# Altium schematic sheet LoRaWAN_CC1310_V1.1.SchDoc
size A3
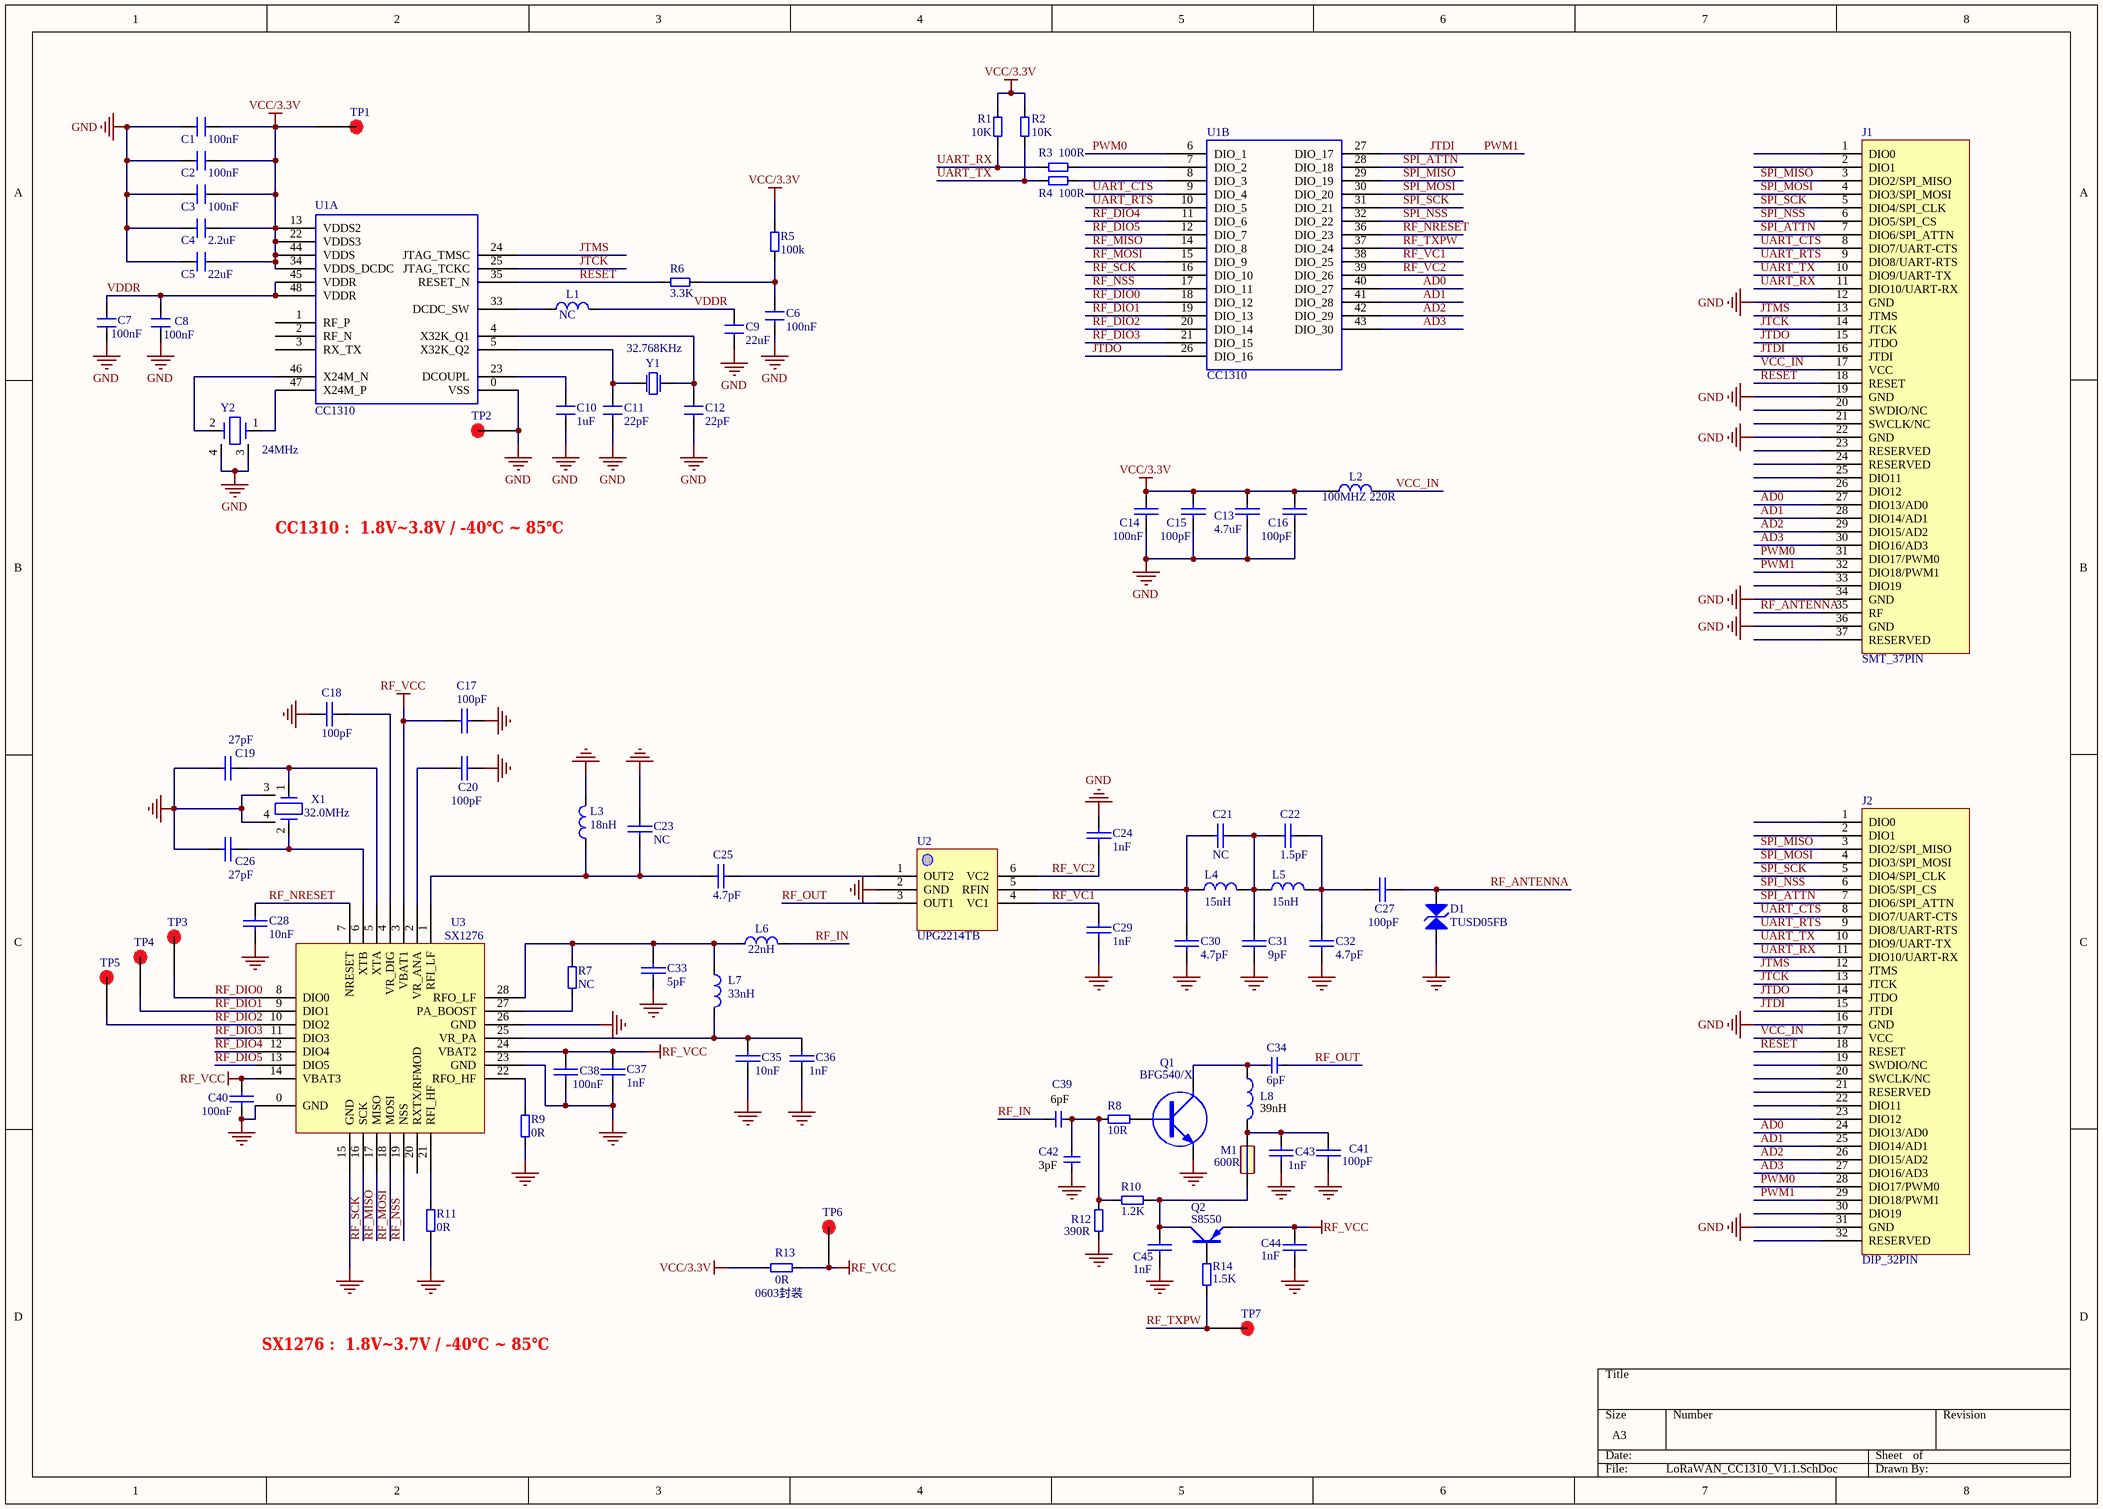
[diagram p0: LoRaWAN_CC1310_V1.1.SchDoc]

## Parts
C1  100nF  [C0402]
C2  100nF  [C0402]
C3  100nF  [C0402]
C4  2.2uF  [C0402]
C5  22uF  [C0402]
C6  100nF  [C0402]
C7  100nF  [C0402]
C8  100nF  [C0805]
C9  22uF  [C0402]
C10  1uF  [C0402]
C11  22pF  [C0402]
C12  22pF  [C0402]
C13  4.7uF  [C0603]
C14  100nF  [0402]
C15  100pF  [0402]
C16  100pF  [0402]
C17  100pF  [C0402]
C18  100pF  [C0402]
C19  27pF  [C0402]
C20  100pF  [C0402]
C21  NC  [C0402]
C22  1.5pF  [C0402]
C23  NC  [C0402]
C24  1nF  [C0402]
C25  4.7pF  [C0402]
C26  27pF  [C0402]
C27  100pF  [C0402]
C28  10nF  [C0402]
C29  1nF  [C0402]
C30  4.7pF  [C0402]
C31  9pF  [C0402]
C32  4.7pF  [C0402]
C33  5pF  [C0402]
C34  6pF  [C0402]
C35  10nF  [C0402]
C36  1nF  [C0402]
C37  1nF  [C0402]
C38  100nF  [C0402]
C39  6pF  [C0402]
C40  100nF  [C0402]
C41  100pF  [C0402]
C42  3pF  [C0402]
C43  1nF  [C0402]
C44  1nF  [C0402]
C45  1nF  [C0402]
D1  TUSD05FB  [ESD/SOD-323]
J1  SMT_37PIN
J2  DIP_32PIN
L1  NC  [L0402]
L2  100MHZ 220R  [L0402]
L3  18nH  [L0402]
L4  15nH  [L0603]
L5  15nH  [L0603]
L6  22nH  [L0402]
L7  33nH  [L0603]
L8  39nH  [L0603]
M1  600R  [L0603]
Q1  BFG540/X  [BFG540/X]
Q2  S8550  [Q/SOT-23]
R1  10K  [R0402]
R2  10K  [R0402]
R3  100R  [R0402]
R4  100R  [R0402]
R5  100k  [R0402]
R6  3.3K  [R0402]
R7  NC  [R0402]
R8  10R  [R0402]
R9  0R  [R0402]
R10  1.2K  [R0402]
R11  0R  [R0402]
R12  390R  [R0402]
R13  0R  [R0603]
R14  1.5K  [R0402]
TP1  (no value)  [TP]
TP2  (no value)  [TP]
TP3  (no value)  [TP]
TP4  (no value)  [TP]
TP5  (no value)  [TP]
TP6  (no value)  [TP]
TP7  (no value)  [TP]
U1  CC1310  [QFN-48/0.5]  (parts A,B of 2)
U2  UPG2214TB  [SOT-363]
U3  SX1276  [QFN-28/0.65]
X1  32.0MHz  [XTAL-3225]
Y1  32.768KHz  [XTAL-3215]
Y2  24MHz  [XTAL-3225]

## Nets
GND: C1.1 C2.1 C3.1 C4.1 C5.1 C6.1 C7.1 C8.1 C9.2 C10.1 C11.1 C12.2 C13.2 C14.2 C15.2 C16.2 C17.2 C18.2 C19.1 C20.2 C23.1 C24.2 C26.1 C28.2 C29.2 C30.2 C31.2 C32.2 C33.2 C35.2 C36.2 C37.2 C38.2 C40.2 C41.2 C42.1 C43.2 C44.2 C45.2 D1.1 J1.12(GND) J1.19(GND) J1.22(GND) J1.34(GND) J1.36(GND) J2.16(GND) J2.31(GND) L3.2 Q1.E R9.2 R11.2 R12.1 TP2.1 U1.0(VSS) U2.2(GND) U3.0(GND) U3.15(GND) U3.23(GND) U3.26(GND) X1.3 X1.4 Y2.3 Y2.4
RF_VCC: C17.1 C37.1 C38.1 C40.1 C44.1 Q2.E R13.2 TP6.1 U3.3(VBAT1) U3.14(VBAT3) U3.24(VBAT2)
VCC/3.3V: C1.2 C2.2 C3.2 C4.2 C5.2 C13.1 C14.1 C15.1 C16.1 L2.1 R1.2 R2.2 R5.1 R13.1 TP1.1 U1.13(VDDS2) U1.22(VDDS3) U1.34(VDDS_DCDC) U1.44(VDDS)
AD0: J1.27(DIO13/AD0) J2.24(DIO13/AD0) U1.40(DIO_27)
AD1: J1.28(DIO14/AD1) J2.25(DIO14/AD1) U1.41(DIO_28)
AD2: J1.29(DIO15/AD2) J2.26(DIO15/AD2) U1.42(DIO_29)
AD3: J1.30(DIO16/AD3) J2.27(DIO16/AD3) U1.43(DIO_30)
JTCK: J1.14(JTCK) J2.13(JTCK) U1.25(JTAG_TCKC)
JTDI: J1.16(JTDI) J1.32(DIO18/PWM1) J2.15(JTDI) J2.29(DIO18/PWM1) U1.27(DIO_17)  [also labelled PWM1]
JTDO: J1.15(JTDO) J2.14(JTDO) U1.26(DIO_16)
JTMS: J1.13(JTMS) J2.12(JTMS) U1.24(JTAG_TMSC)
PWM0: J1.31(DIO17/PWM0) J2.28(DIO17/PWM0) U1.6(DIO_1)
RESET: J1.18(RESET) J2.18(RESET) R6.1 U1.35(RESET_N)
RF_ANTENNA: C27.2 D1.2 J1.35(RF)
RF_DIO0: TP3.1 U1.18(DIO_12) U3.8(DIO0)
RF_DIO1: TP4.1 U1.19(DIO_13) U3.9(DIO1)
RF_DIO2: TP5.1 U1.20(DIO_14) U3.10(DIO2)
RF_DIO3: U1.21(DIO_15) U3.11(DIO3)
RF_DIO4: U1.11(DIO_6) U3.12(DIO4)
RF_DIO5: U1.12(DIO_7) U3.13(DIO5)
RF_IN: C39.2 L6.2
RF_MISO: U1.14(DIO_8) U3.17(MISO)
RF_MOSI: U1.15(DIO_9) U3.18(MOSI)
RF_NRESET: C28.1 U1.36(DIO_23) U3.7(NRESET)
RF_NSS: U1.17(DIO_11) U3.19(NSS)
RF_OUT: C34.1 U2.3(OUT1)
RF_SCK: U1.16(DIO_10) U3.16(SCK)
RF_TXPW: R14.1 TP7.1 U1.37(DIO_24)
RF_VC1: C29.1 U1.38(DIO_25) U2.4(VC1)
RF_VC2: C24.1 U1.39(DIO_26) U2.6(VC2)
SPI_ATTN: J1.7(DIO6/SPI_ATTN) J2.7(DIO6/SPI_ATTN) U1.28(DIO_18)
SPI_MISO: J1.3(DIO2/SPI_MISO) J2.3(DIO2/SPI_MISO) U1.29(DIO_19)
SPI_MOSI: J1.4(DIO3/SPI_MOSI) J2.4(DIO3/SPI_MOSI) U1.30(DIO_20)
SPI_NSS: J1.6(DIO5/SPI_CS) J2.6(DIO5/SPI_CS) U1.32(DIO_22)
SPI_SCK: J1.5(DIO4/SPI_CLK) J2.5(DIO4/SPI_CLK) U1.31(DIO_21)
UART_CTS: J1.8(DIO7/UART-CTS) J2.8(DIO7/UART-CTS) U1.9(DIO_4)
UART_RTS: J1.9(DIO8/UART-RTS) J2.9(DIO8/UART-RTS) U1.10(DIO_5)
UART_RX: J1.11(DIO10/UART-RX) J2.11(DIO10/UART-RX) R1.1 R3.1
UART_TX: J1.10(DIO9/UART-TX) J2.10(DIO9/UART-TX) R2.1 R4.1
VCC_IN: J1.17(VCC) J2.17(VCC) L2.2
VDDR: C7.2 C8.2 C9.1 L1.2 U1.45(VDDR) U1.48(VDDR)
NetC6_2: C6.2 R5.2 R6.2
NetC10_2: C10.2 U1.23(DCOUPL)
NetC11_2: C11.2 U1.5(X32K_Q2) Y1.1(P1)
NetC12_1: C12.1 U1.4(X32K_Q1) Y1.2(P2)
NetC18_1: C18.1 U3.4(VR_DIG)
NetC19_2: C19.2 U3.5(XTA) X1.1
NetC20_1: C20.1 U3.2(VR_ANA)
NetC21_1: C21.1 C30.1 L4.1 U2.5(RFIN)
NetC21_2: C21.2 C22.1 C31.1 L4.2 L5.1
NetC22_2: C22.2 C27.1 C32.1 L5.2
NetC23_2: C23.2 C25.1 L3.1 U3.1(RFI_LF)
NetC25_2: C25.2 U2.1(OUT2)
NetC26_2: C26.2 U3.6(XTB) X1.2
NetC33_1: C33.1 L6.1 L7.1 R7.2 U3.28(RFO_LF)
NetC34_2: C34.2 L8.2 Q1.C
NetC35_1: C35.1 C36.1 L7.2 U3.25(VR_PA)
NetC39_1: C39.1 C42.2 R8.1 R10.1 R12.2
NetC41_1: C41.1 C43.1 L8.1 M1.1
NetC45_1: C45.1 M1.2 Q2.C R10.2
NetL1_1: L1.1 U1.33(DCDC_SW)
NetQ1_B: Q1.B R8.2
NetQ2_B: Q2.B R14.2
NetR3_2: R3.2 U1.7(DIO_2)
NetR4_2: R4.2 U1.8(DIO_3)
NetR7_1: R7.1 U3.27(PA_BOOST)
NetR9_1: R9.1 U3.22(RFO_HF)
NetR11_1: R11.1 U3.21(RFI_HF)
NetU1_46: U1.46(X24M_N) Y2.2
NetU1_47: U1.47(X24M_P) Y2.1

Not connected (* = marked no-connect by the designer): J1 1(DIO0) 2(DIO1) 20(SWDIO/NC) 21(SWCLK/NC) 23(RESERVED) 24(RESERVED) 25(DIO11) 26(DIO12) 33(DIO19) 37(RESERVED); J2 1(DIO0) 2(DIO1) 19(SWDIO/NC) 20(SWCLK/NC) 21(RESERVED) 22(DIO11) 23(DIO12) 30(DIO19) 32(RESERVED); U1 1(RF_P) 2(RF_N) 3(RX_TX); U3 20(RXTX/RFMOD)

## Notes on the sheet
- CC1310 :  1.8V~3.8V / -40℃ ~ 85℃
- (near R13) 0603封装
- SX1276 :  1.8V~3.7V / -40℃ ~ 85℃

## Library data of the parts
C1-C12 = CAP1
C13-C16 = CAP: Capacitor
C17-C33 C35-C38 C40 = C-SMD: 普通贴片电容
C34 C39 C42 = CAP_S: Capacitor
C41 C43-C45 = C/0603: Chip C
D1 = D-ESD: ESD管
L1-L7 = L-SMD: 普通贴片电感
L8 = L/0402: Chip L
M1 = MB
Q1 = NPN
Q2 = PNPS: Transistor
R1-R6 = RES5
R7 R13 = R-SMD: 贴片电阻
R8-R12 R14 = RL2: Resistance
TP1-TP7 = Z-TP
U1 = U-RF-CC1310
U2 = U-Z-UPG2214TB
U3 = U-RF-SX1276
X1 Y2 = Z-XTAL-4P
Y1 = CRYSTAL